# Altium schematic sheet Э3_2.SchDoc: =title_line_1 + title_line_2
size 420 x 297 mm; DrawnBy: Площадная; DocumentNumber: Э3; SheetNumber: 2; SheetTotal: 2; DocumentCode: Э3; title_line_1: плата; title_line_2: ЕТЗ; document_type: схема электрическая принципиальная
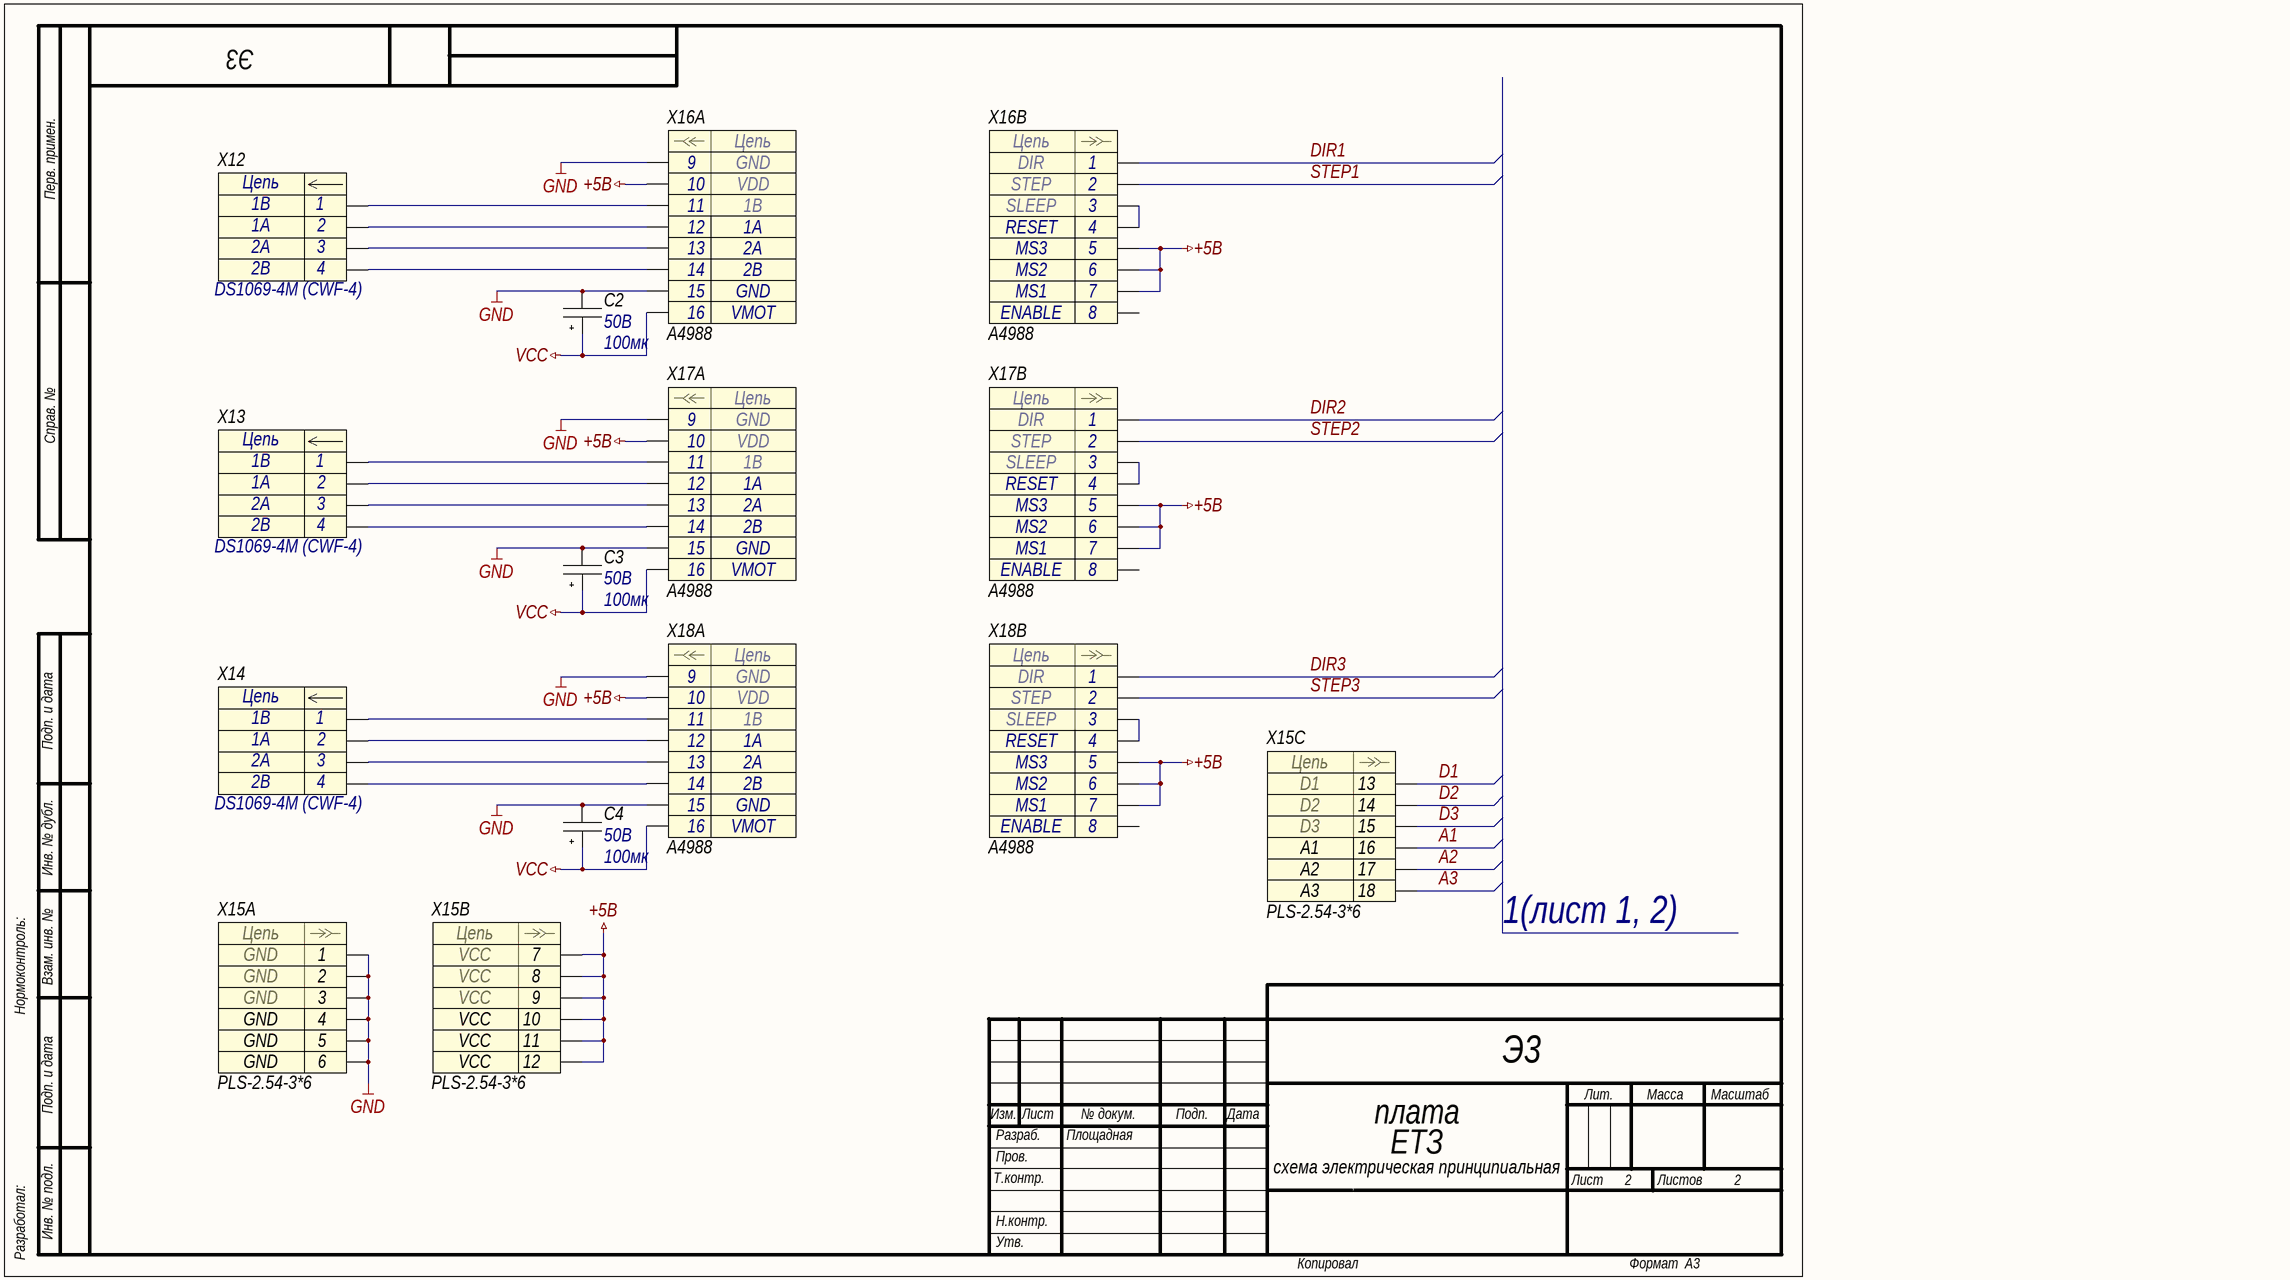
[diagram p0: Э3_2.SchDoc]

## Parts
C2  voltage: 50В  nominal: 100мк  [SK050M0100B3F-0811-up]  (hidden comment: конденсатор)
C3  voltage: 50В  nominal: 100мк  [SK050M0100B3F-0811-up]  (hidden comment: конденсатор)
C4  voltage: 50В  nominal: 100мк  [SK050M0100B3F-0811-up]  (hidden comment: конденсатор)
X12  DS1069-4M (CWF-4)  [CWF-4]
X13  DS1069-4M (CWF-4)  [CWF-4]
X14  DS1069-4M (CWF-4)  [CWF-4]
X15  PLS-2.54-3*6  [PLS-2.54-3*6]  (parts A,B,C of 3)
X16  A4988  [A4988]  (parts A,B of 2)
X17  A4988  [A4988]  (parts A,B of 2)
X18  A4988  [A4988]  (parts A,B of 2)

## Nets
+5В: X15.7 X15.8 X15.9 X15.10 X15.11 X15.12 X16.5 X16.6 X16.7 X16.10 X17.5 X17.6 X17.7 X17.10 X18.5 X18.6 X18.7 X18.10
GND: C2.2 C3.2 C4.2 X15.1 X15.2 X15.3 X15.4 X15.5 X15.6 X16.9 X16.15 X17.9 X17.15 X18.9 X18.15
VCC: C2.1 C3.1 C4.1 X16.16 X17.16 X18.16
A1: X15.16
A2: X15.17
A3: X15.18
D1: X15.13
D2: X15.14
D3: X15.15
DIR1: X16.1
DIR2: X17.1
DIR3: X18.1
STEP1: X16.2
STEP2: X17.2
STEP3: X18.2
NetX12_1: X12.1 X16.11
NetX12_2: X12.2 X16.12
NetX12_3: X12.3 X16.13
NetX12_4: X12.4 X16.14
NetX13_1: X13.1 X17.11
NetX13_2: X13.2 X17.12
NetX13_3: X13.3 X17.13
NetX13_4: X13.4 X17.14
NetX14_1: X14.1 X18.11
NetX14_2: X14.2 X18.12
NetX14_3: X14.3 X18.13
NetX14_4: X14.4 X18.14
NetX16_3: X16.3 X16.4
NetX17_3: X17.3 X17.4
NetX18_3: X18.3 X18.4

Not connected (* = marked no-connect by the designer): X16 8; X17 8; X18 8

## Notes on the sheet
- 1(лист 1, 2)
- Перв. примен.
- Справ. №
- Подп. и дата
- Инв. № дубл.
- Нормоконтроль:
- Взам. инв. №
- Изм.
- Лист
- № докум.
- Подп.
- Дата
- Лит.
- Масса
- Масштаб
- Т.контр.
- Пров.
- Разраб.
- Листов
- Разработал:
- Инв. № подл.
- Н.контр.
- Утв.
- Копировал
- Формат
- А3
- (in symbol A4988, part A) Цепь; GND; VDD; 1B; 1A; 2A; 2B; VMOT
- (in symbol A4988, part B) Цепь; DIR; STEP; SLEEP; RESET; MS3; MS2; MS1; ENABLE
- (in symbol CWF-4) Цепь
- (in symbol PLS-2.54-3*6, part A) Цепь
- (in symbol PLS-2.54-3*6, part B) Цепь
- (in symbol PLS-2.54-3*6, part C) Цепь

## Library data of the parts
C2-C4 = SK050M0100B3F-0811: nam: конденсатор
X12-X14 = CWF-4: Разъем - 4 конт. прямая вилка на плату; Contact_1: 1B; Contact_2: 1A; Contact_3: 2A; Contact_4: 2B; Name: DS1069-4M (CWF-4)
X15 = PLS-2.54-3*6: Contact_1: GND; Contact_7: VCC; Contact_2: GND; Contact_3: GND; Contact_4: GND; Contact_5: GND; Contact_6: GND; Contact_8: VCC; Contact_9: VCC; Contact_10: VCC; Contact_11: VCC; Contact_12: VCC; Contact_13: *; Contact_14: *; Contact_15: *; Contact_16: *; Contact_17: *; Contact_18: *